# Altium schematic sheet [14] - IO SYSTEM.SchDoc
size A3; DocumentNumber: 14; SheetNumber: 14; SheetTotal: 18
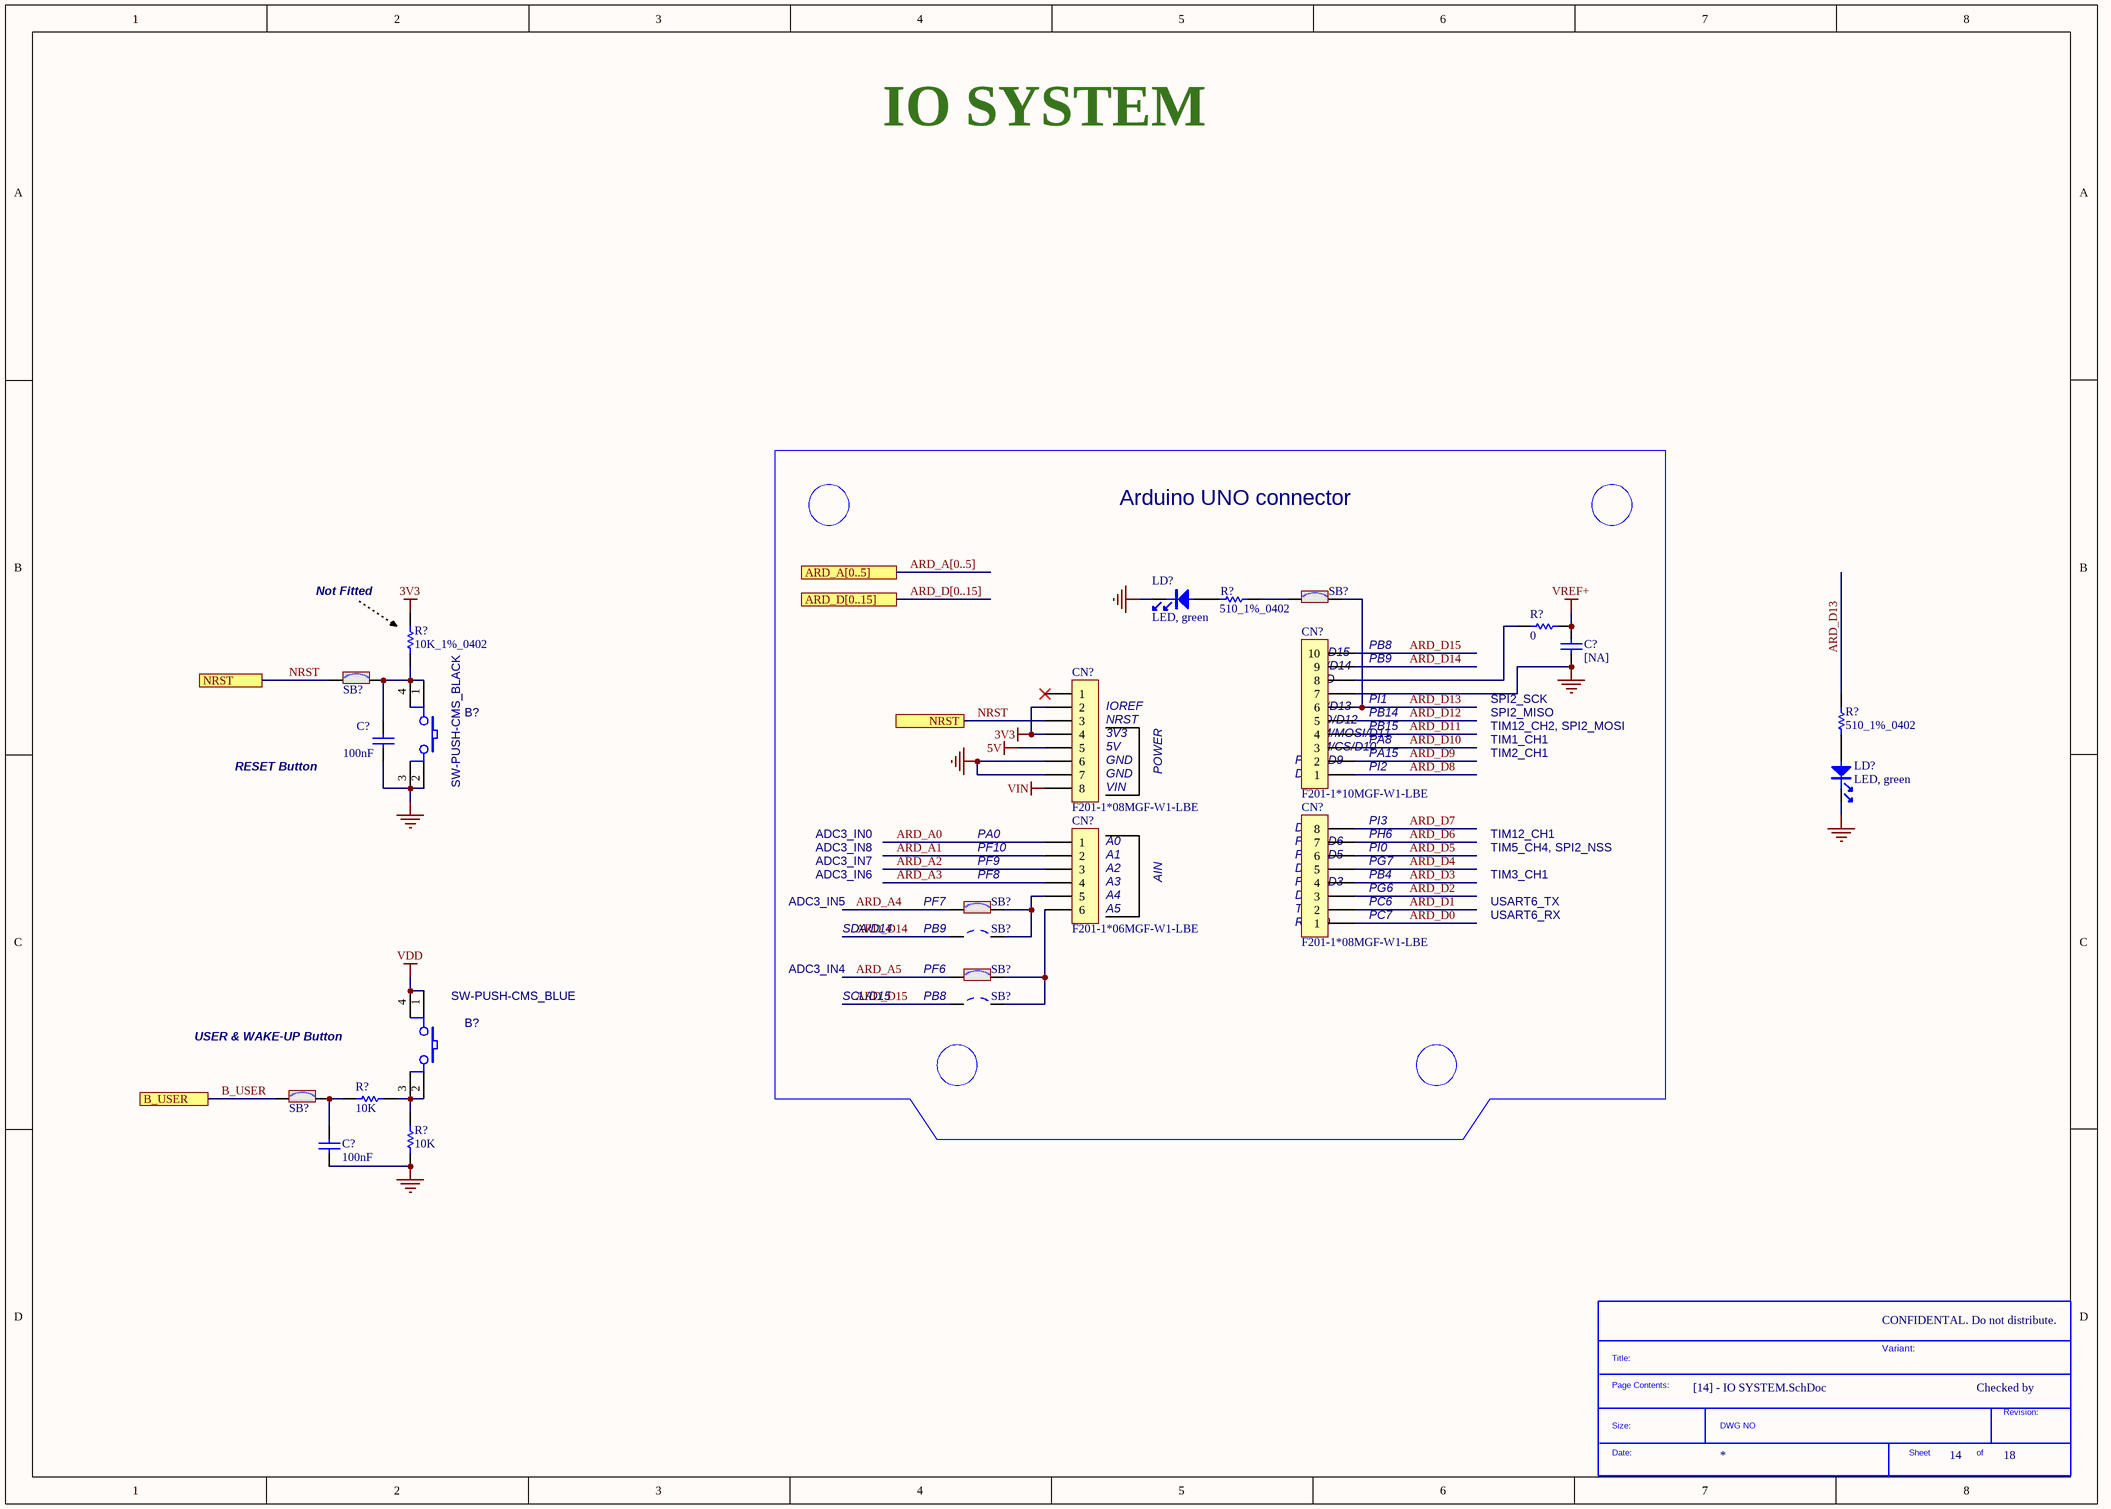
[diagram p0: [14] - IO SYSTEM.SchDoc]

## Parts
(Parts that share a designator on the sheet are numbered #1, #2 ... from top to bottom, then left to right.)
*  SDTitleBlock  (value not drawn)  (graphical)
B?#1  SW-PUSH-CMS_BLACK  [BP1CMS]
B?#2  SW-PUSH-CMS_BLUE  [BP1CMS]
C?#1  [NA]  [0402C]
C?#2  100nF  [0402C]
C?#3  100nF  [0402C]
CN?#1  F201-1*08MGF-W1-LBE  [F201-1*08MGF-W1-BA]
CN?#2  F201-1*10MGF-W1-LBE  [F201-1*10MGF-W1-BA]
CN?#3  F201-1*06MGF-W1-LBE  [F201-1*06MGF-W1-BA]
CN?#4  F201-1*08MGF-W1-LBE  [F201-1*08MGF-W1-BA]
LD?#1  LED, green  [0603D]
LD?#2  LED, green  [0603D]
R?#1  510_1%_0402  [0402R]
R?#2  0  [0402R]
R?#3  10K_1%_0402  [0402R]
R?#4  510_1%_0402  [0402R]
R?#5  10K  [0402R]
R?#6  10K  [0402R]
SB?#1  Solder Bridge ON  [JP2_SMD]  (value not drawn)
SB?#2  Solder Bridge ON  [JP2_SMD]  (value not drawn)
SB?#3  Solder Bridge ON  [JP2_SMD]  (value not drawn)
SB?#4  Solder Bridge OFF  [JP2_SMD]  (value not drawn)
SB?#5  Solder Bridge ON  [JP2_SMD]  (value not drawn)
SB?#6  Solder Bridge OFF  [JP2_SMD]  (value not drawn)
SB?#7  Solder Bridge ON  [JP2_SMD]  (value not drawn)

## Blocks framed on the sheet
Arduino UNO connector: C?#1 CN?#1-CN?#4 LD?#1 R?#1 R?#2 SB?#1 SB?#3-SB?#6

## Ports
ARD_A[0..5], ARD_D[0..15], B_USER, NRST

## Nets
3V3: CN?#1.2 CN?#1.4 R?#3.2
5V: CN?#1.5
GND: B?#1.2 B?#1.3 C?#1.1 C?#2.1 C?#3.1 CN?#1.6 CN?#1.7 CN?#2.7 LD?#1.2 LD?#2.2 R?#6.1
VDD: B?#2.1 B?#2.4
VIN: CN?#1.8
VREF+: C?#1.2 R?#2.2
ARD_A0: CN?#3.1
ARD_A1: CN?#3.2
ARD_A2: CN?#3.3
ARD_A3: CN?#3.4
ARD_A4: SB?#3.1
ARD_A5: SB?#5.1
ARD_D0: CN?#4.1
ARD_D1: CN?#4.2
ARD_D2: CN?#4.3
ARD_D3: CN?#4.4
ARD_D4: CN?#4.5
ARD_D5: CN?#4.6
ARD_D6: CN?#4.7
ARD_D7: CN?#4.8
ARD_D8: CN?#2.1
ARD_D9: CN?#2.2
ARD_D10: CN?#2.3
ARD_D11: CN?#2.4
ARD_D12: CN?#2.5
ARD_D13: CN?#2.6 R?#4.2 SB?#1.2
ARD_D14: CN?#2.9 SB?#4.1
ARD_D15: CN?#2.10 SB?#6.1
B_USER: SB?#7.1 ; port B_USER
NRST: CN?#1.3 SB?#2.1 ; port NRST
NetB?#1_1: B?#1.1 B?#1.4 C?#2.2 R?#3.1 SB?#2.2
NetB?#2_2: B?#2.2 B?#2.3 R?#5.2 R?#6.2
NetC?#3_2: C?#3.2 R?#5.1 SB?#7.2
NetCN?#2_8: CN?#2.8 R?#2.1
NetCN?#3_5: CN?#3.5 SB?#3.2 SB?#4.2
NetCN?#3_6: CN?#3.6 SB?#5.2 SB?#6.2
NetLD?#1_1: LD?#1.1 R?#1.1
NetLD?#2_1: LD?#2.1 R?#4.1
NetR?#1_2: R?#1.2 SB?#1.1

Not connected (* = marked no-connect by the designer): CN?#1 1*

## Buses and harness runs
bus ARD_A[0..5] = port ARD_A[0..5]
bus ARD_D[0..15] = port ARD_D[0..15]

## Notes on the sheet
- IO SYSTEM
- (near R?#3) Not Fitted
- PB8
- (near CN?#1) IOREF
- (near CN?#1) NRST
- (near CN?#2) SDA/D14
- (near CN?#2) SCL/D15
- (near CN?#2) SCK/D13
- (near CN?#2) MISO/D12
- (near CN?#2) AVDD
- (near CN?#2) GND
- (near CN?#2) PB14
- (near CN?#2) PI1
- (near CN?#2) PB9
- SPI2_MISO
- SPI2_SCK
- RESET Button
- (near CN?#1) 3V3
- (near CN?#1) 5V
- (near CN?#1) GND
- POWER
- (near CN?#2) D8
- (near CN?#2) PWM/D9
- (near CN?#2) PWM/CS/D10
- (near CN?#2) PWM/MOSI/D11
- (near CN?#2) PI2
- (near CN?#2) PA15
- (near CN?#2) PA8
- (near CN?#2) PB15
- TIM2_CH1
- TIM1_CH1
- TIM12_CH2, SPI2_MOSI
- ADC3_IN8
- ADC3_IN0
- PA0
- PF10
- (near CN?#3) A0
- (near CN?#3) A1
- (near CN?#1) VIN
- (near CN?#4) PWM/D5
- (near CN?#4) PWM/D6
- (near CN?#4) D7
- (near CN?#4) PI0
- (near CN?#4) PH6
- (near CN?#4) PI3
- TIM5_CH4, SPI2_NSS
- TIM12_CH1
- ADC3_IN5
- ADC3_IN6
- ADC3_IN7
- (near SB?#3) PF7
- (near SB?#3) PF9
- (near SB?#3) PF8
- (near CN?#3) A2
- (near CN?#3) A3
- (near CN?#3) A4
- (near CN?#3) A5
- AIN
- (near CN?#4) TX/D1
- (near CN?#4) D2
- (near CN?#4) D4
- (near CN?#4) PWM/D3
- (near CN?#4) PC6
- (near CN?#4) PG6
- (near CN?#4) PB4
- (near CN?#4) PG7
- (near CN?#4) PC7
- USART6_RX
- USART6_TX
- TIM3_CH1
- ADC3_IN4
- SDA/D14
- (near SB?#5) PF6
- (near SB?#4) PB9
- (near CN?#4) RX/D0
- USER & WAKE-UP Button
- SCL/D15
- (near SB?#6) PB8
- CONFIDENTAL. Do not distribute.
- CLOCKS (CPU & PCIE)
- Variant:
- Checked by
- (in symbol SDTitleBlock) Title:; Page Contents:; Revision:; Size:; DWG NO; Date:; Sheet; of

## Library data of the parts
B?#1 = SW-PUSH-CMS_BLACK: Non-Open Push-Button 0.1A 24V; Manuf_2: FARNELL; Manuf_Part_2: 535-930; Manuf_1: wealthmetal; Manuf_Part_1: TD0341X-G01-BLA; Ref St: 9180120; Distrib: JFVNY; ECCN_US/EU: n/a
B?#2 = SW-PUSH-CMS_BLUE: Non-Open Push-Button 0.1A 24V; Manuf_2: FARNELL; Manuf_Part_2: 535-930; Manuf_1: wealthmetal; Manuf_Part_1: TD0341X-G01-BLU; Ref St: 9180120; Distrib: JFVNY; ECCN_US/EU: n/a
C?#1 = Cap_NA_0402: Capacitor,NA,0402; Fitted: NO; Revision: July-2002: Re-released for DXP Platform.; Value: [NA]; ECCN_US/EU: n/a
C?#2 C?#3 = Cap_100nF_X7R_10%_0402: Capacitor,100nF,16V,X7R,10%,0402,YAGEO; Manuf_Part_1: CC0402KRX7R7BB104; Revision: July-2002: Re-released for DXP Platform.; Value: 100nF; Order: CC0402KRX7R7BB104; Manuf_1: YAGEO
CN?#1 CN?#4 = F201-1*08MGF-W1-BA: Header, 8-Pins, Single row, female SMD; Manuf_1: TOWNES; Manuf_Part_2: SSW-108-22-L-S-VS; Manuf_2: SAMTEC; Manuf_Part_1: F201-1*08MGF-W1-LBE; Distrib: Sub Co; ECCN_US/EU: n/a
CN?#2 = F201-1*10MGF-W1-BA: Header, 10-Pins, Single row, female SMD; Manuf_1: TOWNES; Manuf_Part_2: SSW-110-22-L-S-VS; Manuf_2: SAMTEC; Manuf_Part_1: F201-1*10MGF-W1-LBE; Distrib: Sub Co; ECCN_US/EU: n/a
CN?#3 = F201-1*06MGF-W1-BA: Header, 6-Pins, Single row, female SMD; Manuf_1: TOWNES; Manuf_Part_2: SSW-106-22-L-S-VS; Manuf_2: SAMTEC; Manuf_Part_1: F201-1*06MGF-W1-LBE; Distrib: Sub Co; ECCN_US/EU: n/a
LD?#1 LD?#2 = LED_green: LED, green, 0603; Manuf_1: everlight; Manuf_Part_1: 19-213SYGC/S530-E2/TR8; ECCN_US/EU: EAR99/NEC; Order: 19-213SYGC/S530-E2/TR8
R?#1 R?#4 = Res_510_1%_0402: Resistor,510,0402,1%,YAGEO; Manuf_Part_1: RC0402FR-07510L; Value: 510; Manuf_1: YAGEO; Order: RC0402FR-07510L; ECCN_US/EU: n/a; Distrib: DIGIKEY
R?#2 = Res_0_5%_0402: Resistor,0,0402,5%,YAGEO; Manuf_Part_1: RC0402JR-070RL; Order: 2363467; Value: 0; ECCN_US/EU: n/a; Manuf_1: YAGEO; Distrib: FARNELL
R?#3 = Res_10K_1%_0402: Resistor,10K,0402,1%,YAGEO; Manuf_Part_1: RC0402FR-0710KL; Fitted: NO; Value: 10K; Manuf_1: YAGEO; Order: RC0402FR-0710KL; ECCN_US/EU: n/a
R?#5 R?#6 = Res_10K_1%_0402: Resistor,10K,0402,1%,YAGEO; Manuf_Part_1: RC0402FR-0710KL; Value: 10K; Manuf_1: YAGEO; Order: RC0402FR-0710KL; ECCN_US/EU: n/a
SB?#1-SB?#3 SB?#5 SB?#7 = SB_ON: Solder: YES; Revision: July-2002: Re-released for DXP Platform.; ECCN_US/EU: n/a
SB?#4 SB?#6 = SB_OFF: Solder: NO; Revision: July-2002: Re-released for DXP Platform.; ECCN_US/EU: n/a